# Altium schematic sheet Schield_elkapod.SchDoc
size A4; SheetNumber: 1; SheetTotal: 4
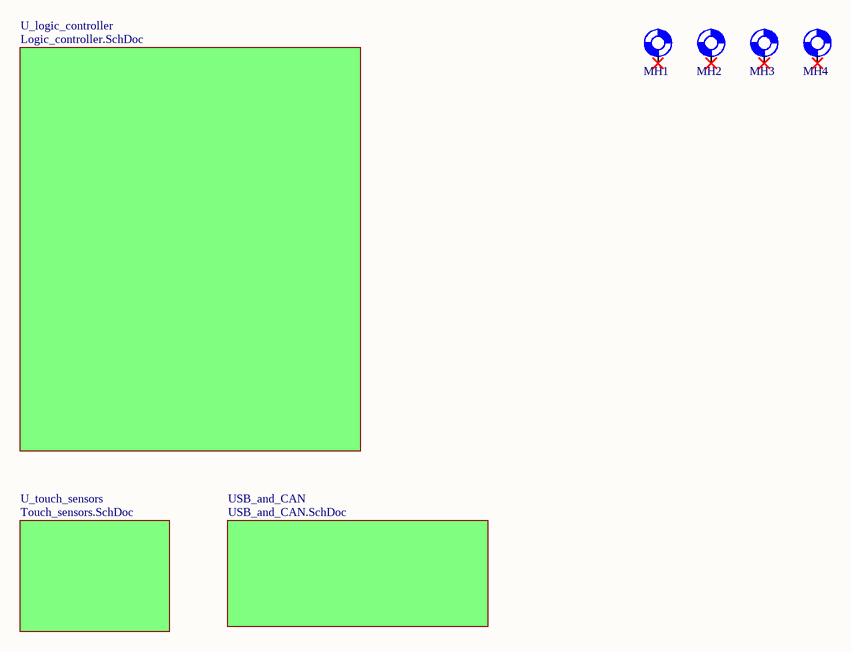
[diagram p0: Schield_elkapod.SchDoc]

## Parts
MH1  M3 Mounting Hole  [M3_MOUNTING_HOLE]  (value not drawn)
MH2  M3 Mounting Hole  [M3_MOUNTING_HOLE]  (value not drawn)
MH3  M3 Mounting Hole  [M3_MOUNTING_HOLE]  (value not drawn)
MH4  M3 Mounting Hole  [M3_MOUNTING_HOLE]  (value not drawn)

## Sub-sheets
U_logic_controller = Logic_controller.SchDoc: no entries
U_touch_sensors = Touch_sensors.SchDoc: no entries
USB_and_CAN = USB_and_CAN.SchDoc: no entries

## Nets

Not connected (* = marked no-connect by the designer): MH1 1*; MH2 1*; MH3 1*; MH4 1*